# Altium schematic sheet UFC-PCB.SchDoc
size A3
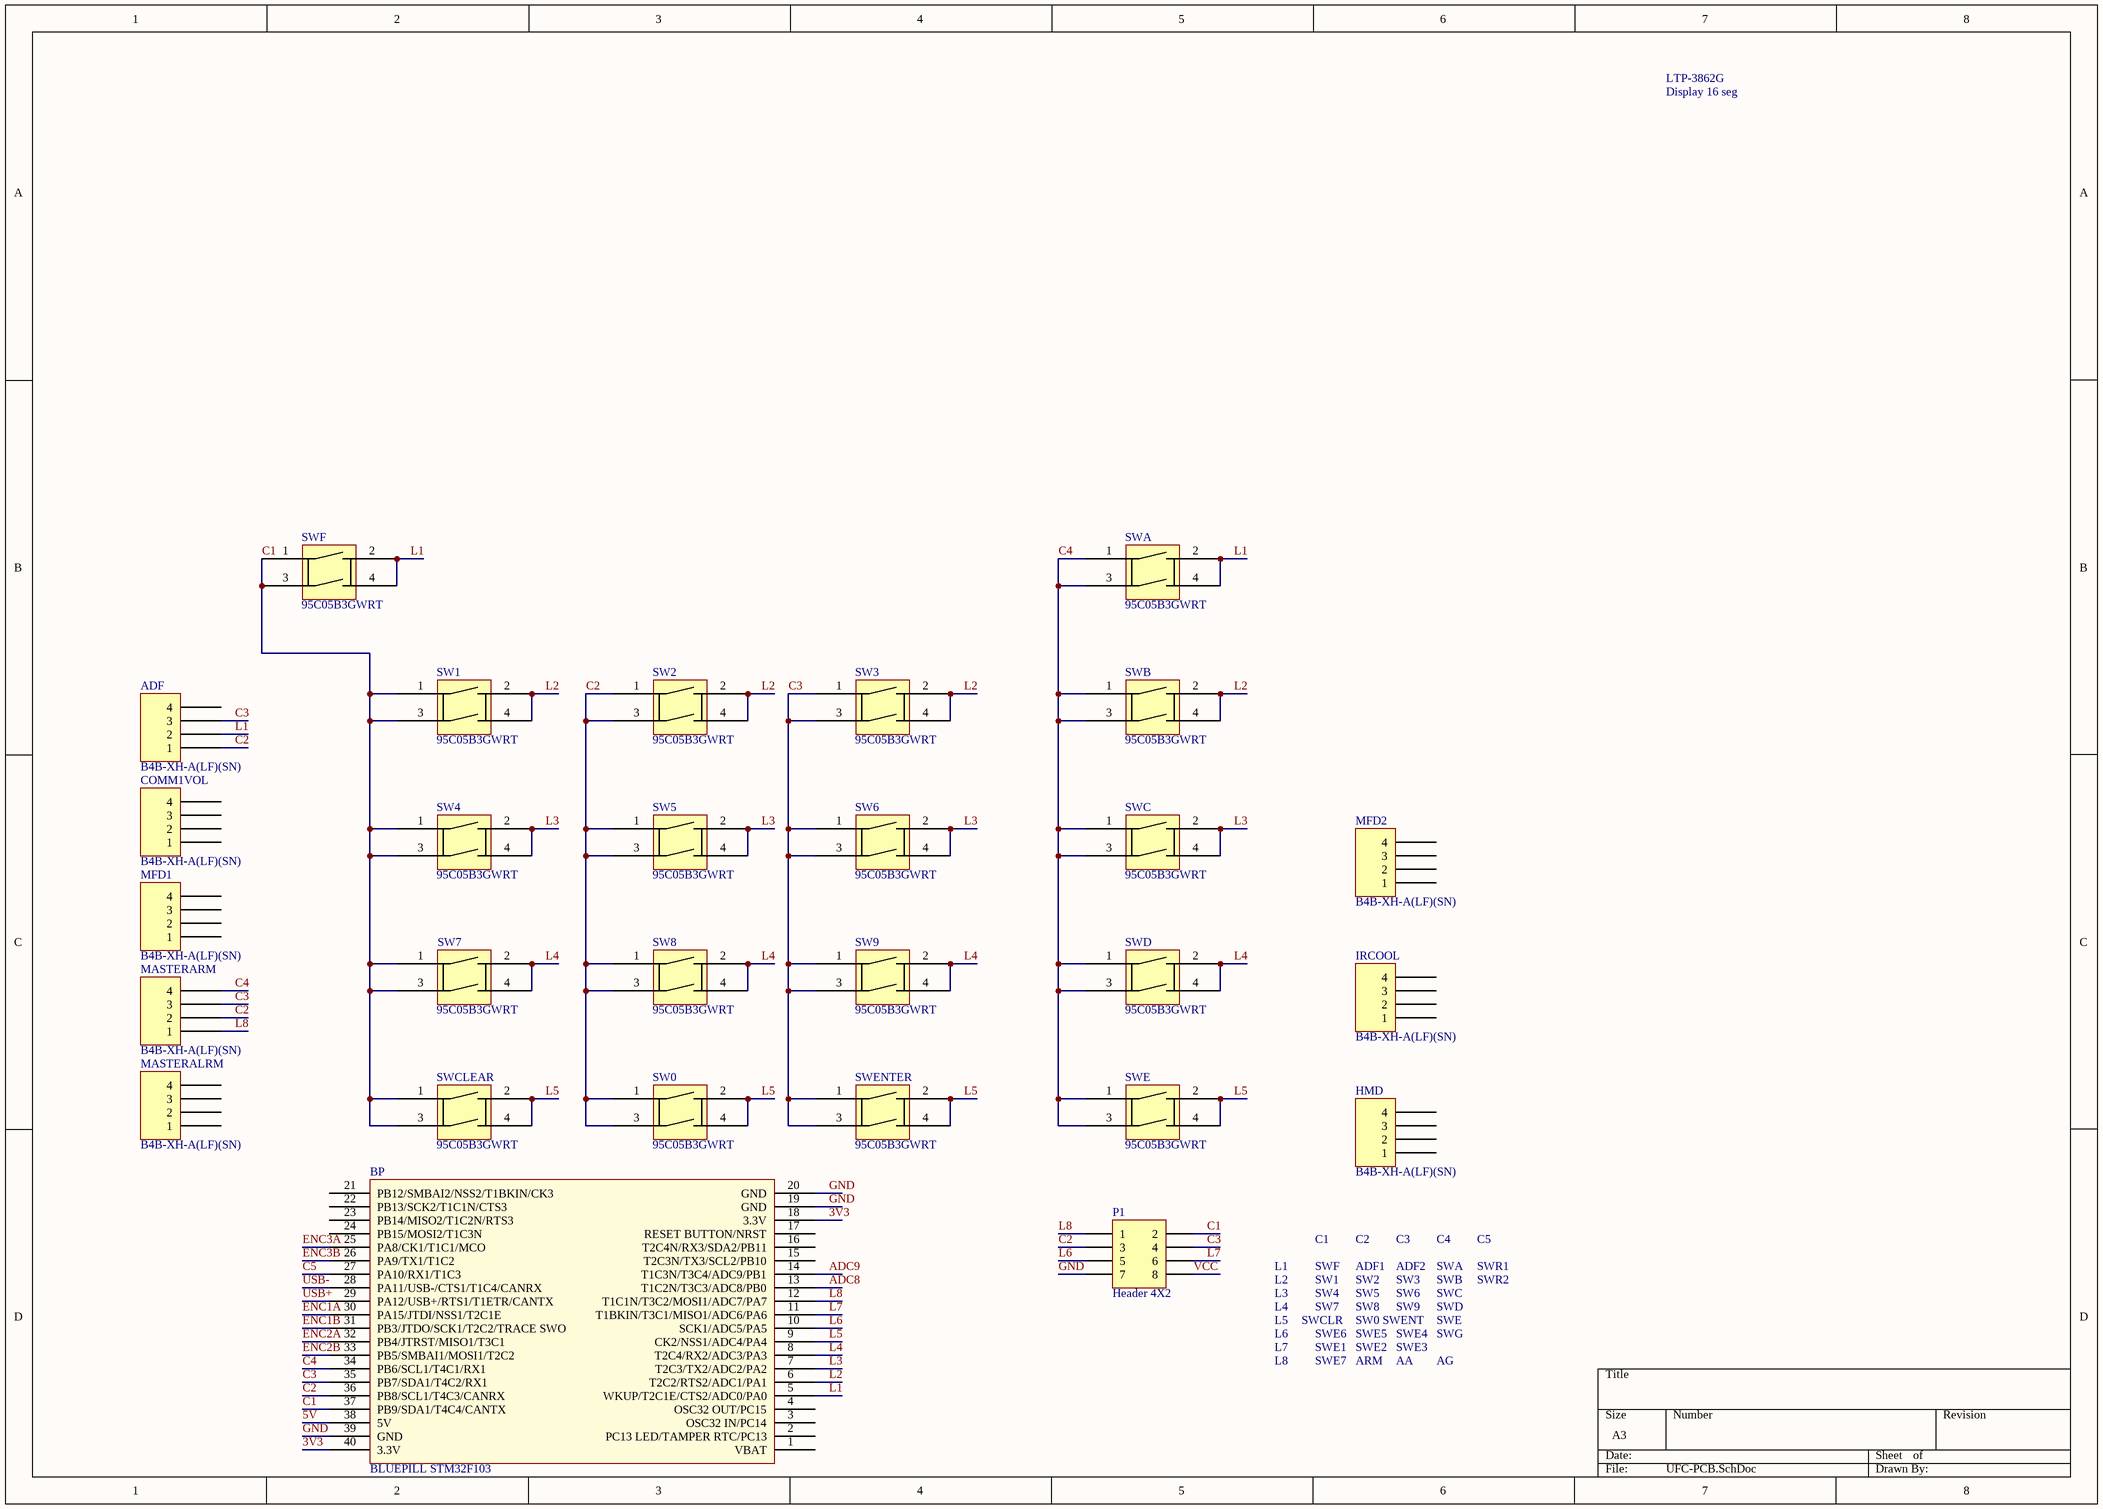
[diagram p0: UFC-PCB.SchDoc]

## Parts
ADF  B4B-XH-A(LF)(SN)  [New footprint 1]
BP  BLUEPILL STM32F103  [BLUEPILL-PCB]
COMM1VOL  B4B-XH-A(LF)(SN)  [New footprint 1]
HMD  B4B-XH-A(LF)(SN)  [New footprint 1]
IRCOOL  B4B-XH-A(LF)(SN)  [New footprint 1]
MASTERALRM  B4B-XH-A(LF)(SN)  [New footprint 1]
MASTERARM  B4B-XH-A(LF)(SN)  [New footprint 1]
MFD1  B4B-XH-A(LF)(SN)  [New footprint 1]
MFD2  B4B-XH-A(LF)(SN)  [New footprint 1]
P1  Header 4X2  [HDR2X4]
SW0  95C05B3GWRT  [TACTILE-SWITCH-4P]
SW1  95C05B3GWRT  [TACTILE-SWITCH-4P]
SW2  95C05B3GWRT  [TACTILE-SWITCH-4P]
SW3  95C05B3GWRT  [TACTILE-SWITCH-4P]
SW4  95C05B3GWRT  [TACTILE-SWITCH-4P]
SW5  95C05B3GWRT  [TACTILE-SWITCH-4P]
SW6  95C05B3GWRT  [TACTILE-SWITCH-4P]
SW7  95C05B3GWRT  [TACTILE-SWITCH-4P]
SW8  95C05B3GWRT  [TACTILE-SWITCH-4P]
SW9  95C05B3GWRT  [TACTILE-SWITCH-4P]
SWA  95C05B3GWRT  [TACTILE-SWITCH-4P]
SWB  95C05B3GWRT  [TACTILE-SWITCH-4P]
SWC  95C05B3GWRT  [TACTILE-SWITCH-4P]
SWCLEAR  95C05B3GWRT  [TACTILE-SWITCH-4P]
SWD  95C05B3GWRT  [TACTILE-SWITCH-4P]
SWE  95C05B3GWRT  [TACTILE-SWITCH-4P]
SWENTER  95C05B3GWRT  [TACTILE-SWITCH-4P]
SWF  95C05B3GWRT  [TACTILE-SWITCH-4P]

## Nets
3V3: BP.18(3.3V) BP.40(3.3V)
5V: BP.38(5V)
ADC8: BP.13(T1C2N/T3C3/ADC8/PB0)
ADC9: BP.14(T1C3N/T3C4/ADC9/PB1)
C1: BP.37(PB9/SDA1/T4C4/CANTX) P1.2 SW1.1 SW1.3 SW4.1 SW4.3 SW7.1 SW7.3 SWCLEAR.1 SWCLEAR.3 SWF.1 SWF.3
C2: ADF.1 BP.36(PB8/SCL1/T4C3/CANRX) MASTERARM.2 P1.3 SW0.1 SW0.3 SW2.1 SW2.3 SW5.1 SW5.3 SW8.1 SW8.3
C3: ADF.3 BP.35(PB7/SDA1/T4C2/RX1) MASTERARM.3 P1.4 SW3.1 SW3.3 SW6.1 SW6.3 SW9.1 SW9.3 SWENTER.1 SWENTER.3
C4: BP.34(PB6/SCL1/T4C1/RX1) MASTERARM.4 SWA.1 SWA.3 SWB.1 SWB.3 SWC.1 SWC.3 SWD.1 SWD.3 SWE.1 SWE.3
C5: BP.27(PA10/RX1/T1C3)
ENC1A: BP.30(PA15/JTDI/NSS1/T2C1E)
ENC1B: BP.31(PB3/JTDO/SCK1/T2C2/TRACE_SWO)
ENC2A: BP.32(PB4/JTRST/MISO1/T3C1)
ENC2B: BP.33(PB5/SMBAI1/MOSI1/T2C2)
ENC3A: BP.25(PA8/CK1/T1C1/MCO)
ENC3B: BP.26(PA9/TX1/T1C2)
GND: BP.19(GND) BP.20(GND) BP.39(GND) P1.7
L1: ADF.2 BP.5(WKUP/T2C1E/CTS2/ADC0/PA0) SWA.2 SWA.4 SWF.2 SWF.4
L2: BP.6(T2C2/RTS2/ADC1/PA1) SW1.2 SW1.4 SW2.2 SW2.4 SW3.2 SW3.4 SWB.2 SWB.4
L3: BP.7(T2C3/TX2/ADC2/PA2) SW4.2 SW4.4 SW5.2 SW5.4 SW6.2 SW6.4 SWC.2 SWC.4
L4: BP.8(T2C4/RX2/ADC3/PA3) SW7.2 SW7.4 SW8.2 SW8.4 SW9.2 SW9.4 SWD.2 SWD.4
L5: BP.9(CK2/NSS1/ADC4/PA4) SW0.2 SW0.4 SWCLEAR.2 SWCLEAR.4 SWE.2 SWE.4 SWENTER.2 SWENTER.4
L6: BP.10(SCK1/ADC5/PA5) P1.5
L7: BP.11(T1BKIN/T3C1/MISO1/ADC6/PA6) P1.6
L8: BP.12(T1C1N/T3C2/MOSI1/ADC7/PA7) MASTERARM.1 P1.1
USB+: BP.29(PA12/USB+/RTS1/T1ETR/CANTX)
USB-: BP.28(PA11/USB-/CTS1/T1C4/CANRX)
VCC: P1.8

Not connected (* = marked no-connect by the designer): ADF 4; BP 1(VBAT) 2(PC13_LED/TAMPER_RTC/PC13) 3(OSC32_IN/PC14) 4(OSC32_OUT/PC15) 15(T2C3N/TX3/SCL2/PB10) 16(T2C4N/RX3/SDA2/PB11) 17(RESET_BUTTON/NRST) 21(PB12/SMBAI2/NSS2/T1BKIN/CK3) 22(PB13/SCK2/T1C1N/CTS3) 23(PB14/MISO2/T1C2N/RTS3) 24(PB15/MOSI2/T1C3N); COMM1VOL 1 2 3 4; HMD 1 2 3 4; IRCOOL 1 2 3 4; MASTERALRM 1 2 3 4; MFD1 1 2 3 4; MFD2 1 2 3 4

## Notes on the sheet
- LTP-3862G
- Display 16 seg
- C1
- C2
- C3
- C4
- C5
- L1
- L2
- L3
- L4
- L5
- SWCLR
- SWF
- SW1
- SW4
- SW7
- SW2
- SW5
- SW8
- SW0
- ADF1
- SWENT
- SW3
- SW6
- SW9
- ADF2
- SWA
- SWB
- SWC
- SWD
- SWE
- SWR1
- SWR2
- L6
- L7
- L8
- SWE7
- SWE1
- SWE6
- SWE2
- SWE5
- ARM
- SWE3
- SWE4
- AA
- SWG
- AG

## Library data of the parts
ADF COMM1VOL HMD IRCOOL MASTERALRM MASTERARM MFD1 MFD2 = B4B-XH-A(LF)(SN)-1: JST (JAPAN SOLDERLESS TERMINALS) - B4B-XH-A (LF)(SN) - Wire-To-Board-Steckverbinder, vertikal, 2.5 mm, 4 Kontakt(e), Stiftleiste, Baureihe XH; Wire/Cable Gauge: 22AWG; Max Voltage Rating (DC): 250V; Connector Type: Male Pin; Pitch: 2.5mm; Contact Resistance: 20mR; Max Current Rating: 3A; Gender: Male; Insulation Resistance: 1GR; Number of Positions: 4; Material: Polyamide; Max Operating Temperature: 85°C; Orientation: Straight; Housing Color: White; Contact Plating: Tin,Copper,Lead; Lead Free: Lead Free; Mount: Through Hole; Voltage Rating (AC): 250V; Depth: 5.75mm; Min Operating Temperature: -25°C; Housing Material: Polyamide; Length: 12.4mm; Package Quantity: 500; Voltage Rating: 250V; Lead Pitch: 2.5mm; Number of Rows: 1; Number of Contacts: 4; Packaging: Bulk; Color: Natural; REACH SVHC: No SVHC; Contact Material: Brass; Termination: Press-Fit; Current Rating: 3A; Max Voltage Rating (AC): 250V
BP = BLUEPILL-1: STM32 Blue Pill Development Module
P1 = Header 4X2: Header, 4-Pin, Dual row; LatestRevisionDate: 17-Jul-2002; LatestRevisionNote: Re-released for DXP Platform.; Publisher: Altium Limited
SW0-SW9 SWA SWB SWC SWCLEAR SWD SWE SWENTER SWF = 95C05B3GWRT-4: SWITCH TACTILE SPST-NO 0.05A 12V; Cod EMS: 05.283.001.096; Part No: 95C05B3GWRT